# Altium schematic sheet LAN9252-1.SchDoc
size B
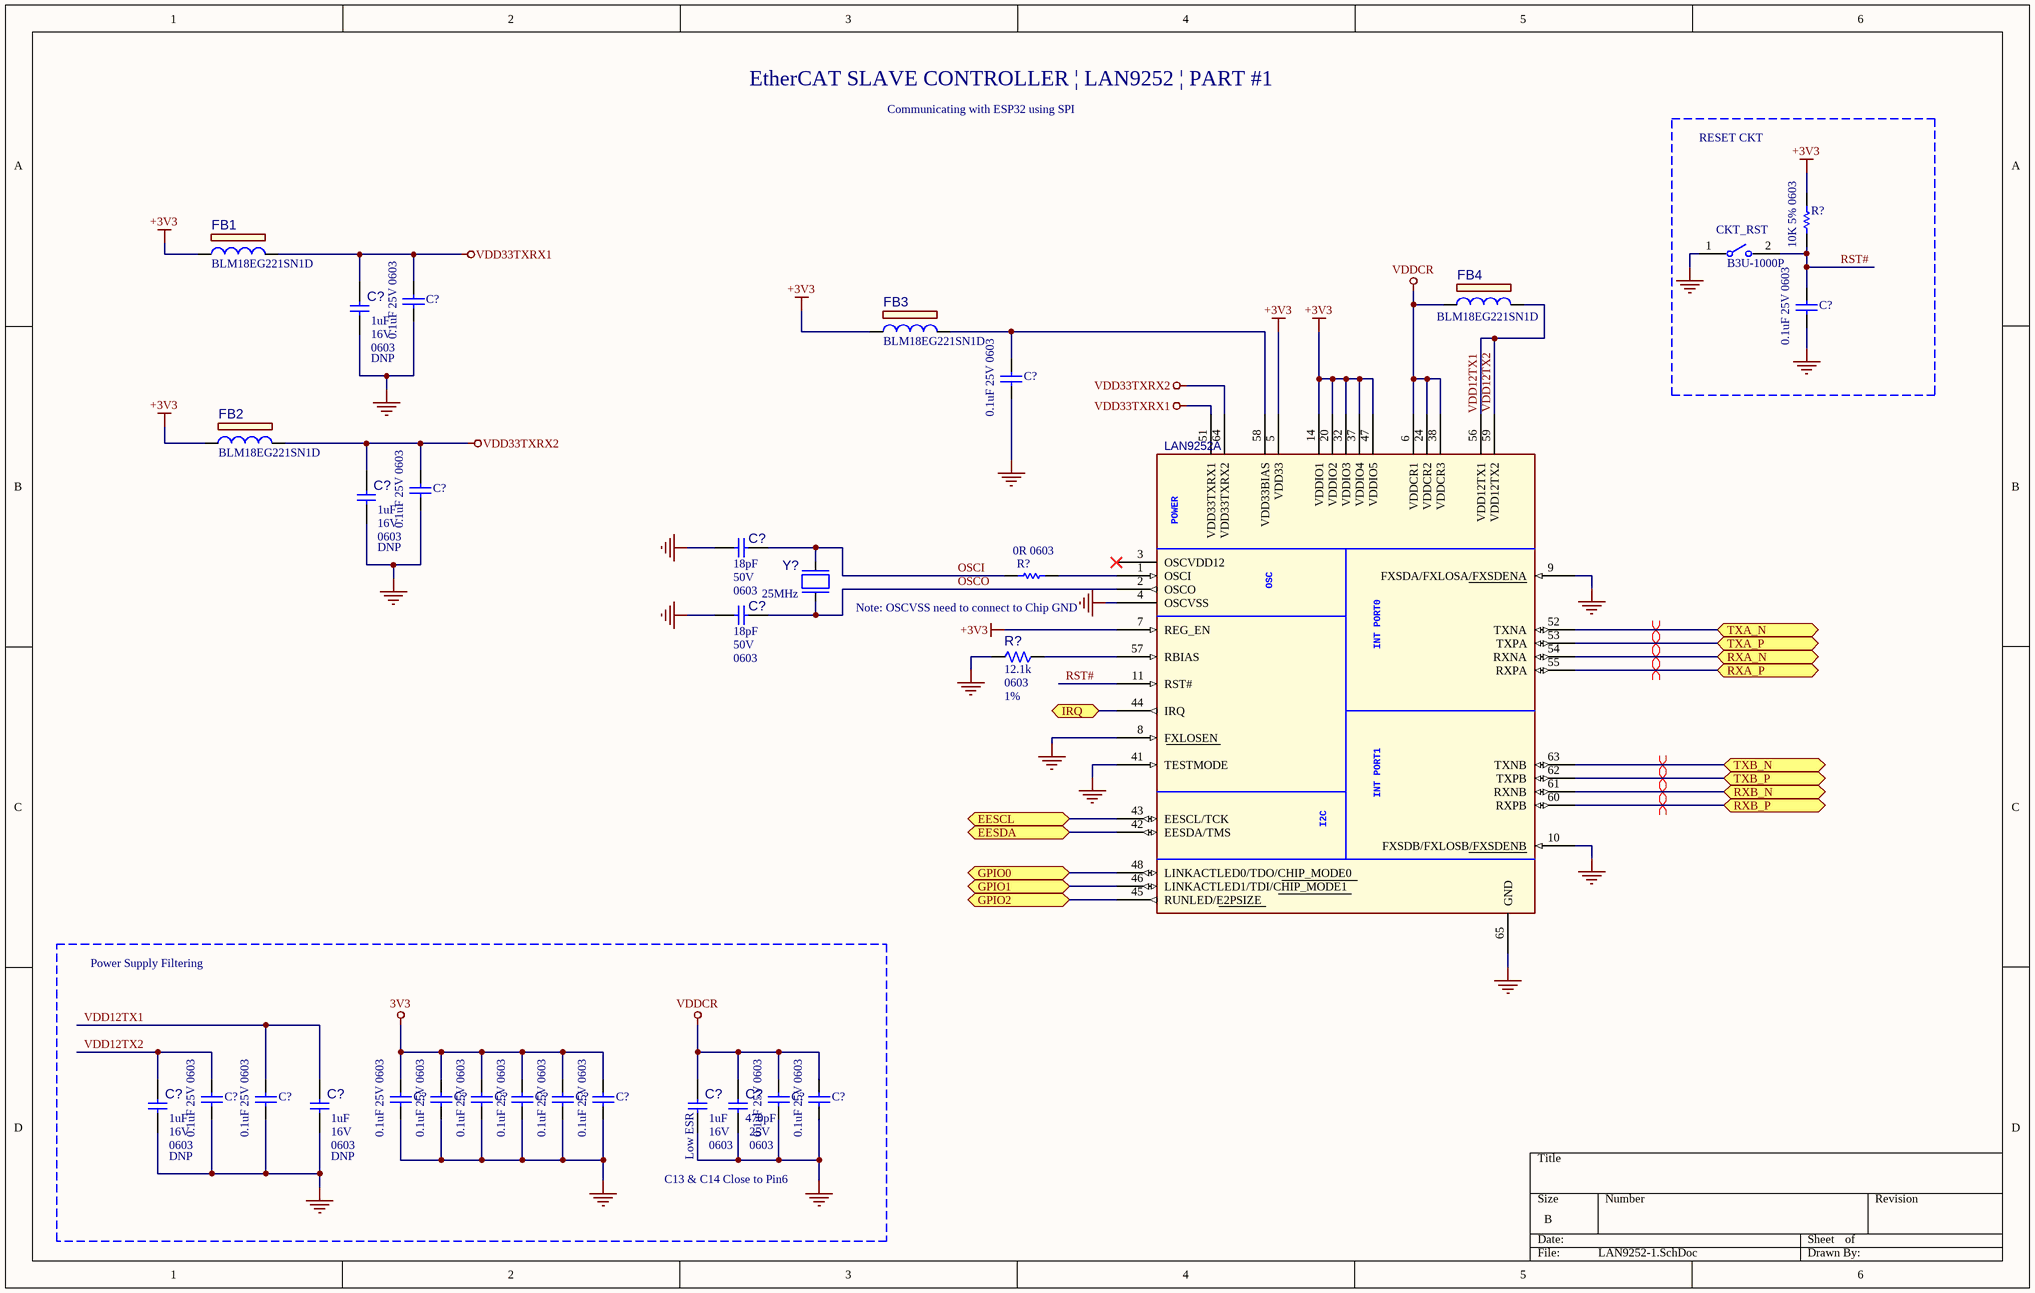
[diagram p0: LAN9252-1.SchDoc]

## Parts
(Parts that share a designator on the sheet are numbered #1, #2 ... from top to bottom, then left to right.)
C?#1  0.1uF 25V 0603  [CAPC1608X90X35LL10T15]
C?#2  0.1uF 25V 0603  [CAPC1608X90X35LL10T15]
C?#3  value 1uF  Voltage: 16V  Package: 0603  Populated: DNP  [CAP_C_0603]  (hidden comment: Capacitor NP)
C?#4  0.1uF 25V 0603  [CAPC1608X90X35LL10T15]
C?#5  0.1uF 25V 0603  [CAPC1608X90X35LL10T15]
C?#6  value 1uF  Voltage: 16V  Package: 0603  Populated: DNP  [CAP_C_0603]  (hidden comment: Capacitor NP)
C?#7  value 18pF  Voltage: 50V  Package: 0603  [CAP_C_0603]  (hidden comment: Capacitor NP)
C?#8  value 18pF  Voltage: 50V  Package: 0603  [CAP_C_0603]  (hidden comment: Capacitor NP)
C?#9  0.1uF 25V 0603  [CAPC1608X90X35LL10T15]
C?#10  0.1uF 25V 0603  [CAPC1608X90X35LL10T15]
C?#11  0.1uF 25V 0603  [CAPC1608X90X35LL10T15]
C?#12  0.1uF 25V 0603  [CAPC1608X90X35LL10T15]
C?#13  0.1uF 25V 0603  [CAPC1608X90X35LL10T15]
C?#14  0.1uF 25V 0603  [CAPC1608X90X35LL10T15]
C?#15  0.1uF 25V 0603  [CAPC1608X90X35LL10T15]
C?#16  0.1uF 25V 0603  [CAPC1608X90X35LL10T15]
C?#17  0.1uF 25V 0603  [CAPC1608X90X35LL10T15]
C?#18  0.1uF 25V 0603  [CAPC1608X90X35LL10T15]
C?#19  value 1uF  Voltage: 16V  Package: 0603  Populated: DNP  [CAP_C_0603]  (hidden comment: Capacitor NP)
C?#20  value 1uF  Voltage: 16V  Package: 0603  Populated: DNP  [CAP_C_0603]  (hidden comment: Capacitor NP)
C?#21  value 1uF  Voltage: 16V  Package: 0603  [CAP_C_0603]  (hidden comment: Capacitor NP)
C?#22  value 470pF  Voltage: 25V  Package: 0603  [CAP_C_0603]  (hidden comment: Capacitor NP)
CKT_RST  B3U-1000P  [FP-B3U-1000P-MFG]
FB1  value BLM18EG221SN1D  [SMD_0603]  (hidden comment: FERRITE BLM18EG221SN1D)
FB2  value BLM18EG221SN1D  [SMD_0603]  (hidden comment: FERRITE BLM18EG221SN1D)
FB3  value BLM18EG221SN1D  [SMD_0603]  (hidden comment: FERRITE BLM18EG221SN1D)
FB4  value BLM18EG221SN1D  [SMD_0603]  (hidden comment: FERRITE BLM18EG221SN1D)
LAN9252  (no value)  [QFN-64_9x9_EP6SQ]  (part A of 2)
R?#1  10K 5% 0603  [RESC1608X55X25ML10T15]
R?#2  0R 0603  [RESC1608X55X25ML10T15]
R?#3  value 12.1k  Package: 0603  Tolerance: 1%  [RES_C_0603]  (hidden comment: Resistor)
Y?  Frequency: 25MHz  [CRYSTAL_HC49-SMD-B]  (hidden comment: XTAL 25MHz HC49/US)

## Blocks framed on the sheet
RESET CKT: C?#2 CKT_RST R?#1

## Ports
EESCL (bidir), EESDA (bidir), GPIO0 (bidir), GPIO1 (bidir), GPIO2 (bidir), IRQ (bidir), RXA_N (bidir), RXA_P (bidir), RXB_N (bidir), RXB_P (bidir), TXA_N (bidir), TXA_P (bidir), TXB_N (bidir), TXB_P (bidir)

## Nets
3V3: C?#11.2 C?#12.2 C?#13.2 C?#14.2 C?#15.2 C?#16.2
+3V3: FB1.1 FB2.1 FB3.1 LAN9252.5(VDD33) LAN9252.7(REG_EN) LAN9252.14(VDDIO1) LAN9252.20(VDDIO2) LAN9252.32(VDDIO3) LAN9252.37(VDDIO4) LAN9252.47(VDDIO5) R?#1.2
GND: C?#1.1 C?#2.1 C?#3.1 C?#4.1 C?#5.1 C?#6.1 C?#7.1 C?#8.1 C?#9.1 C?#10.1 C?#11.1 C?#12.1 C?#13.1 C?#14.1 C?#15.1 C?#16.1 C?#17.1 C?#18.1 C?#19.1 C?#20.1 C?#21.1 C?#22.1 CKT_RST.1 LAN9252.4(OSCVSS) LAN9252.8(FXLOSEN) LAN9252.9(FXSDA/FXLOSA/FXSDENA) LAN9252.10(FXSDB/FXLOSB/FXSDENB) LAN9252.41(TESTMODE) LAN9252.65(GND) R?#3.1
VDD33TXRX1: C?#1.2 C?#3.2 FB1.2 LAN9252.51(VDD33TXRX1)
VDD33TXRX2: C?#5.2 C?#6.2 FB2.2 LAN9252.64(VDD33TXRX2)
VDDCR: C?#17.2 C?#18.2 C?#21.2 C?#22.2 FB4.1 LAN9252.6(VDDCR1) LAN9252.24(VDDCR2) LAN9252.38(VDDCR3)
EESCL: LAN9252.43(EESCL/TCK) ; port EESCL
EESDA: LAN9252.42(EESDA/TMS) ; port EESDA
GPIO0: LAN9252.48(LINKACTLED0/TDO/CHIP_MODE0) ; port GPIO0
GPIO1: LAN9252.46(LINKACTLED1/TDI/CHIP_MODE1) ; port GPIO1
GPIO2: LAN9252.45(RUNLED/E2PSIZE) ; port GPIO2
IRQ: LAN9252.44(IRQ) ; port IRQ
OSCI: C?#7.2 R?#2.1 Y?.2(Osc2)
OSCO: C?#8.2 LAN9252.2(OSCO) Y?.1(Osc1)
RST#: C?#2.2 CKT_RST.2 LAN9252.11(RST#) R?#1.1
RXA_N: LAN9252.54(RXNA) ; port RXA_N
RXA_P: LAN9252.55(RXPA) ; port RXA_P
RXB_N: LAN9252.61(RXNB) ; port RXB_N
RXB_P: LAN9252.60(RXPB) ; port RXB_P
TXA_N: LAN9252.52(TXNA) ; port TXA_N
TXA_P: LAN9252.53(TXPA) ; port TXA_P
TXB_N: LAN9252.63(TXNB) ; port TXB_N
TXB_P: LAN9252.62(TXPB) ; port TXB_P
VDD12TX1: C?#9.2 C?#10.2 C?#19.2 C?#20.2 FB4.2 LAN9252.56(VDD12TX1) LAN9252.59(VDD12TX2)  [also labelled VDD12TX2]
NetC?#4_2: C?#4.2 FB3.2 LAN9252.58(VDD33BIAS)
NetLAN9252_1: LAN9252.1(OSCI) R?#2.2
NetLAN9252_57: LAN9252.57(RBIAS) R?#3.2

Not connected (* = marked no-connect by the designer): LAN9252 3(OSCVDD12)*

## Layout directives
differential pair: RXA_N, RXA_P, RXB_N, RXB_P, TXA_N, TXA_P, TXB_N, TXB_P

## Notes on the sheet
- EtherCAT SLAVE CONTROLLER | LAN9252 | PART #1
- Communicating with ESP32 using SPI
- Note: OSCVSS need to connect to Chip GND
- Power Supply Filtering
- (near C?#21) Low ESR
- C13 & C14 Close to Pin6
- (in symbol LAN9252_QFN64, part A) POWER; OSC; INT PORT0; INT PORT1; I2C

## Library data of the parts
C?#1 C?#2 C?#4 C?#5 C?#9-C?#18 = CMP-2006-02868-1: Part Number: GRM188R71E104KA01D; Manufacturer: Murata
C?#3 C?#6 C?#19 C?#20 = CAP0265: Capacitor; Manufacturer 1: AVX; Manufacturer Part Number 1: 0603YD105KAT2A; Description_: CAP CER 1uF 16V 10% X5R SMD 0603; Tolerance: 10%; Temperature Coeffcient: X5R; Type: Ceramic; MCHP-ID: CAP0265; Revision: 1; Status: Production; ComponentLink1URL: https://chn-vm-apps.microchip.com/mchprepo/parts/Datasheets/smccp.pdf; ComponentLink1Description: Datasheet; Operating Temperature: -55C to +85C; Category: Capacitor; Manufacturer 2: Murata; Manufacturer Part Number 2: GRM188R61C105KA93D; Manufacturer 3: Murata; Manufacturer Part Number 3: GRM185R61C105KE44D; Manufacturer 4: Panasonic; Manufacturer Part Number 4: ECJ-1VB1C105K; Manufacturer 5: Taiyo Yuden; Manufacturer Part Number 5: EMK107BJ105KA-T; Manufacturer 6: TDK; Manufacturer Part Number 6: C1608X5R1C105K; Supplier 1: Digi-Key; Supplier Part Number 1: 478-1249-1-ND; Supplier 2: Digi-Key; Supplier Part Number 2: 490-1536-1-ND; Supplier 3: Digi-Key; Supplier Part Number 3: 490-3894-1-ND; Supplier 4: Digi-Key; Supplier Part Number 4: PCC2224CT-ND; Supplier 5: Digi-Key; Supplier Part Number 5: 587-1251-1-ND; Supplier 6: Digi-Key; Supplier Part Number 6: 445-1416-1-ND; Quantity Override: 1
C?#7 C?#8 = CAP0063: Capacitor; Manufacturer 1: KEMET; Manufacturer Part Number 1: C0603C180J5GACTU; Description_: CAP CER 18pF 50V 5% NP0 SMD 0603; Tolerance: 5%; Temperature Coeffcient: NP0; Type: Ceramic; Populated: Yes; MCHP-ID: CAP0063; Revision: 1; Status: Production; ComponentLink1URL: https://chn-vm-apps.microchip.com/mchprepo/parts/Datasheets/ECJ__General_.pdf; ComponentLink1Description: Datasheet; Operating Temperature: -55C to +125C; Category: Capacitor; Manufacturer 2: TDK; Manufacturer Part Number 2: C1608C0G1H180J; Manufacturer 3: Murata; Manufacturer Part Number 3: GRM1885C1H180JA01D; Manufacturer 4: Panasonic; Manufacturer Part Number 4: ECJ-1VC1H180J; Supplier 1: Digi-Key; Supplier Part Number 1: 399-1052-1-ND; Supplier 2: Digi-Key; Supplier Part Number 2: 445-1272-1-ND; Supplier 3: Digi-Key; Supplier Part Number 3: 490-1409-1-ND; Supplier 4: Digi-Key; Supplier Part Number 4: PCC180ACVCT-ND; Quantity Override: 1
C?#21 = CAP0265: Capacitor; Manufacturer 1: AVX; Manufacturer Part Number 1: 0603YD105KAT2A; Description_: CAP CER 1uF 16V 10% X5R SMD 0603; Tolerance: 10%; Temperature Coeffcient: X5R; Type: Ceramic; Populated: Yes; MCHP-ID: CAP0265; Revision: 1; Status: Production; ComponentLink1URL: https://chn-vm-apps.microchip.com/mchprepo/parts/Datasheets/smccp.pdf; ComponentLink1Description: Datasheet; Operating Temperature: -55C to +85C; Category: Capacitor; Manufacturer 2: Murata; Manufacturer Part Number 2: GRM188R61C105KA93D; Manufacturer 3: Murata; Manufacturer Part Number 3: GRM185R61C105KE44D; Manufacturer 4: Panasonic; Manufacturer Part Number 4: ECJ-1VB1C105K; Manufacturer 5: Taiyo Yuden; Manufacturer Part Number 5: EMK107BJ105KA-T; Manufacturer 6: TDK; Manufacturer Part Number 6: C1608X5R1C105K; Supplier 1: Digi-Key; Supplier Part Number 1: 478-1249-1-ND; Supplier 2: Digi-Key; Supplier Part Number 2: 490-1536-1-ND; Supplier 3: Digi-Key; Supplier Part Number 3: 490-3894-1-ND; Supplier 4: Digi-Key; Supplier Part Number 4: PCC2224CT-ND; Supplier 5: Digi-Key; Supplier Part Number 5: 587-1251-1-ND; Supplier 6: Digi-Key; Supplier Part Number 6: 445-1416-1-ND; Quantity Override: 1
C?#22 = CAP0603: Capacitor; Manufacturer 1: AVX; Manufacturer Part Number 1: 06033A471JAT2A; Description_: CAP CER 470pF 25V 5% NP0 SMD 0603; Tolerance: 5%; Temperature Coeffcient: NP0; Type: Ceramic; Populated: Yes; MCHP-ID: CAP0603; Revision: 1; Status: Production; ComponentLink1URL: https://chn-vm-apps.microchip.com/mchprepo/parts/Datasheets/smccp.pdf; ComponentLink1Description: Datasheet; Operating Temperature: -55C to +125C; Category: Capacitor; Supplier 1: Digi-Key; Supplier Part Number 1: 478-6201-1-ND; Quantity Override: 1
CKT_RST = CMP-2100-03586-2: SWITCH TACTILE SPST-NO 0.05A 12V; Contact Resistance: 100mR; Operating Force: 1.5N; Max Current Rating: 50mA; Switch Travel: 0.15mm; Actuator Type: Standard; Mechanical Life: 200000Cycles; Ratings: Dust Proof; Illumination Type: Non-Illuminated; Throw Configuration: SPST; Actuator Length: 0.4mm; Switch Function: Off-Mom; Height: 1.2mm; Width: 3mm; Weight: 0.000776oz; Contact Material: Silver; Max Voltage Rating (DC): 12V; Insulation Resistance: 100MR; Lead Free: Lead Free; Current Rating: 50mA; Termination: SMD/SMT; Length: 4mm; Voltage Rating (DC): 12V; Contact Current Rating: 50mA; Orientation: Straight; Depth: 2.5mm; Max Operating Temperature: 70°C; Packaging: Tape and Reel; Min Operating Temperature: -25°C; Package Quantity: 1; Mount: Surface Mount; Electrical Life: 200000Cycles
FB1-FB4 = FERRITE BLM18EG221SN1D: FERRITE BEAD 2A 220OHM 0603; Manufacturer 1: Murata Electronics North America; Owner: Manikandan; DCR: 50ohm; Populated: YES; Symbol: Ferrite Bead; Description_: FERRITE BEAD 2A 220OHM 0603; ComponentLink1URL: http://search.murata.co.jp/Ceramy/image/img/PDF/ENG/L0110S0101BLM18E.pdf; ComponentLink1Description: Datasheet; Operating Temperature: -55C to +125C; Package: 0603; Type: Ferrite Bead; Category: Ferrite Bead; Manufacturer Part Number 1: BLM18EG221SN1D; Supplier 1: Digi-Key; Supplier Part Number 1: 490-3992-1-ND; Quantity Override: 1
LAN9252 = LAN9252_QFN64: IC, 2/3-Port EtherCAT® Slave Controller, QFN64; Manufacturer Part Number 1: LAN9252x/ML; Manufacturer 1: Microchip; Populated: Yes; Owner: Manikandan; Supplier Part Number 1: LAN9252I/ML-ND; Supplier 1: Digikey; Description_: IC, 2/3-Port EtherCAT® Slave Controller, QFN64; RoHS: Yes; Package: QFN64-9X9x1; Document Link: http://ww1.microchip.com/downloads/en/DeviceDoc/00001909A.pdf; Status: New
R?#1 = CMP-2100-03664-1: Chip Resistor, 10 KOhm, +/- 1%, 01 W, -55 to 155 degC, 0603 (1608 Metric), RoHS, Tape and Reel; Manufacturer: Yageo; Temperature Coefficient: 100ppm/degreesC; Resistance: 10KOhm; Voltage Rating: 75V; Power Rating: 100mW; Voltage Rating (DC): 50V; Composition: ThickFilm; RoHSCompliant: true; Height: 0.45mm; Lead Free: LeadFree; Case Code (Metric): 1608; Case/Package: 0603; Datasheet Version: Rev. 5, 10/2016; Package Reference: 0603; Depth: 0.8mm; Package Description: 2-Pin Surface Mount Device, Body 1.6 x 0.8 mm; Case Code (Imperial): 0603; Packaging: TapeandReel; Termination: SMD/SMT; Lead Pitch: 0.3mm; Width: 0.8mm; Number of Pins: 2; Length: 1.6mm; REACH SVHC: NoSVHC; Military Standard: Not; Max Operating Temperature: 155degC; Min Operating Temperature: -55degC; Manufacturer URL: http://www.yageo.com/; Datasheet URL: http://www.yageo.com/NewPortal/yageodocoutput?fileName=/pdf/R-Chip/PYu-RC_Group_51_RoHS_L_5.pdf; Weight: 7.1E-05oz; Tolerance: 1%
R?#2 = CMP-2100-03667-1: Chip Resistor, 0 Ohm, +/- 5%, 0.1 W, -55 to 155 degC, 0603 (1608 Metric), RoHS, Tape and Reel; Manufacturer: Yageo; Temperature Coefficient: 200ppm/degreesC; Voltage Rating: 50V; Power Rating: 100mW; Resistance: 0mOhm; Width: 0.8mm; Max Operating Temperature: 155degC; Tolerance: 5%; Package Reference: 0603; Height: 0.45mm; Depth: 0.8mm; Package Description: 2-Pin Surface Mount Device, Body 1.6 x 0.8 mm; Termination: SMD/SMT; Package Quantity: 5000; Case/Package: 0603; Case Code (Imperial): 0603; Radiation Hardening: No; Number of Pins: 2; Length: 1.6mm; Lead Free: LeadFree; Voltage Rating (DC): 50V; Military Standard: Not; Datasheet URL: http://www.yageo.com/NewPortal/yageodocoutput?fileName=/pdf/R-Chip/PYu-RC_Group_51_RoHS_L_5.pdf; Manufacturer URL: http://www.yageo.com/; Packaging: TapeandReel; Case Code (Metric): 1608; Min Operating Temperature: -55degC; Composition: ThickFilm; RoHSCompliant: true; Contact Plating: Tin; Datasheet Version: Rev. 5, 10/2016; REACH SVHC: NoSVHC
R?#3 = RSMT0414: Manufacturer 1: Panasonic; Manufacturer Part Number 1: ERJ-3EKF1212V; Description_: RES TKF 12.1k 1% 1/10W SMD 0603; Voltage: 75V; Temperature Coeffcient: 100ppm/C; Power: 1/10W; Populated: Yes; MCHP-ID: RSMT0414; Revision: 1; Status: Production; ComponentLink1URL: https://chn-vm-apps.microchip.com/mchprepo/parts/Datasheets/AOA0000CE2.pdf; ComponentLink1Description: Datasheet; Operating Temperature: -55C to +155C; Category: Resistor; Type: RES SMD; Composition: TKF; Manufacturer 2: ROHM; Manufacturer Part Number 2: MCR03EZPFX1212; Manufacturer 3: SET; Manufacturer Part Number 3: RMCF1/1612.1K1%TR; Supplier 1: Digi-Key; Supplier Part Number 1: P12.1KHCT-ND; Supplier 2: Digi-Key; Supplier Part Number 2: RHM12.1KHCT-ND; Supplier 3: SET; Supplier Part Number 3: RMCF1/1612.1K1%TR; Quantity Override: 1
Y? = XTAL 25MHz HC49US: Crystal 25MHz HC49/US; Manufacturer: Murata Electronics North America; Frequency Stability: ±30ppm; Load Capacitance: 6pF; Operating Mode: Fundamental; Revision: A; Supplier 1: Mouser; RoHS: RoHS Compliant; Category: Crystals and Oscillators; Stock 1: 4385; Pricing 1: 1=0.52, 10=0.434, 50=0.3894, 100=0.3465, 500=0.33, 1000=0.2772 (USD); Packaging: Cut Tape (CT); Type: MHz Crystal; Frequency Tolerance: ±30ppm; Operating Temperature: -30°C ~ 85°C; Ratings: -; Mounting Type: Surface Mount; Package / Case: HC49/US